# EAGLE design esp_sch (EAGLE 7.5.0)
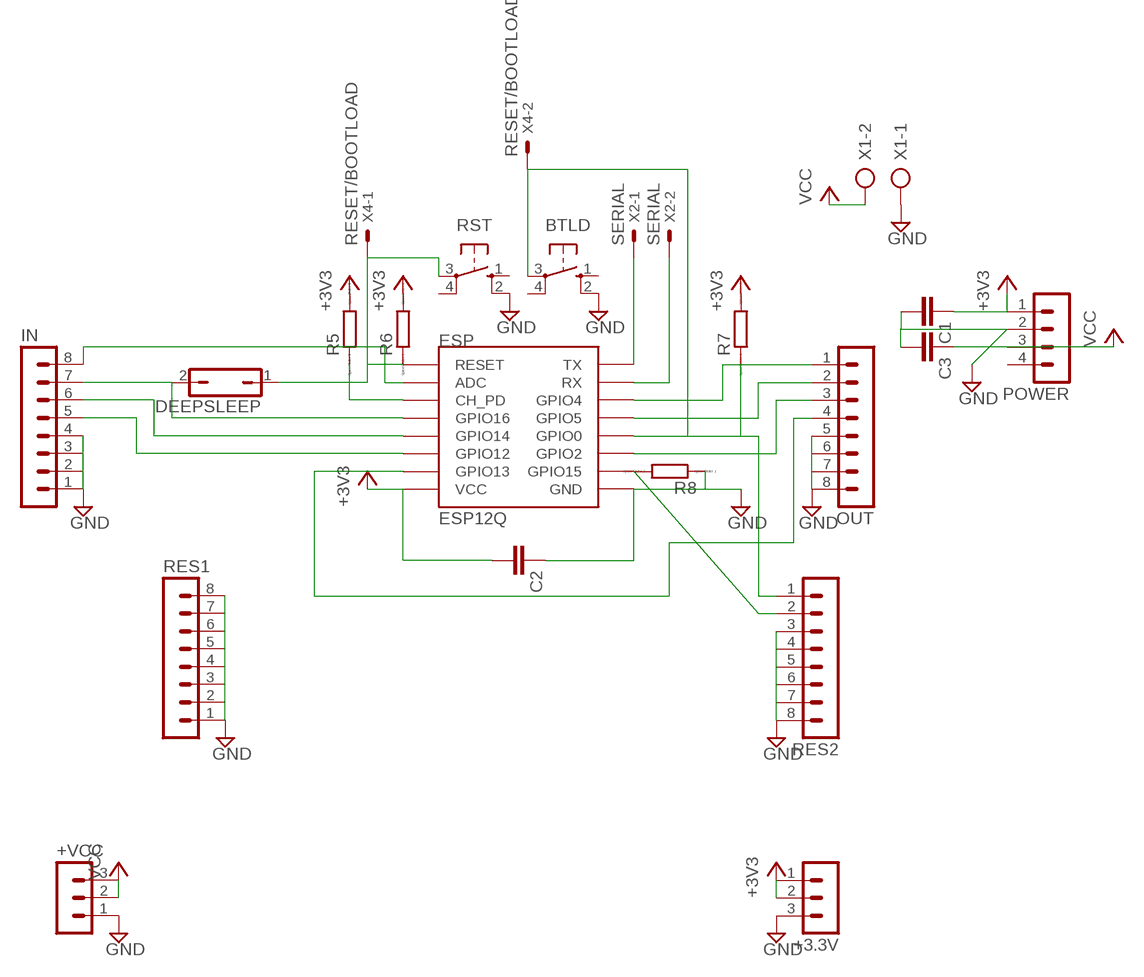
[diagram p0: schematic, sheet 1]

## Parts
+3.3V  MA03-1  [MA03-1]
+VCC  MA03-1  [MA03-1]
BTLD  10-XX  [B3F-10XX]
C1  C-EU025-024X044  [C025-024X044]
C2  C-EU025-024X044  [C025-024X044]
C3  C-EU025-024X044  [C025-024X044]
DEEPSLEEP  JP1Q  [JP1]
ESP  ESP12Q  [ESP12Q]
IN  MA08-1  [MA08-1]
OUT  MA08-1  [MA08-1]
POWER  MA04-1  [MA04-1]
R5  R  [R0805]
R6  R  [R0805]
R7  R  [R0805]
R8  R  [R0805]
RES1  MA08-1  [MA08-1]
RES2  MA08-1  [MA08-1]
RST  10-XX  [B3F-10XX]
X1  AK300/2  [AK300/2]
X2  SERIAL  332-02  [332-02]
X4  RESET/BOOTLOAD  332-02  [332-02]

## Nets
+3V3: +3.3V.1 +3.3V.2 C1.1 C2.2 ESP.VCC POWER.1 R5.2 R6.2 R7.2
GND: +3.3V.3 +VCC.1 BTLD.2(S1) C1.2 C2.1 C3.2 ESP.GND IN.1 IN.2 IN.3 IN.4 OUT.5 OUT.6 OUT.7 OUT.8 POWER.2 R8.1 RES1.1 RES1.2 RES1.3 RES1.4 RES1.5 RES1.6 RES1.7 RES1.8 RES2.3 RES2.4 RES2.5 RES2.6 RES2.7 RES2.8 RST.2(S1) X1.1
N$1: ESP.ADC IN.8
N$2: BTLD.3(P) ESP.GPIO0 R7.1 RES2.1 X4.2
N$3: ESP.CH_PD R5.1
N$4: ESP.GPIO15 R8.2 RES2.2
N$5: ESP.TX X2.1
N$6: ESP.RX X2.2
N$7: ESP.GPIO14 IN.6
N$8: ESP.GPIO12 IN.5
N$9: ESP.GPIO13 OUT.4
N$10: ESP.GPIO4 OUT.1
N$11: ESP.GPIO5 OUT.2
N$12: DEEPSLEEP.2 ESP.GPIO16 IN.7
N$13: ESP.GPIO2 OUT.3
N$15: DEEPSLEEP.1 ESP.RESET R6.1 RST.3(P) X4.1
VCC: +VCC.2 +VCC.3 C3.1 POWER.3 X1.2
Unconnected: BTLD.1(S) BTLD.4(P1) POWER.4 RST.1(S) RST.4(P1)

## Library data of the parts
+3.3V +VCC = con-lstb:MA03-1: PIN HEADER; OC_FARNELL: unknown; OC_NEWARK: unknown
BTLD RST = switch-omron:10-XX: OMRON SWITCH; MPN: B3F-1000; OC_FARNELL: 176432; OC_NEWARK: 36M3542
C1-C3 = rcl:C-EU: CAPACITOR, European symbol
DEEPSLEEP = jumper:JP1Q: JUMPER
ESP = esp826612q:ESP12Q
IN OUT RES1 RES2 = con-lstb:MA08-1: PIN HEADER; OC_FARNELL: unknown; OC_NEWARK: unknown
POWER = con-lstb:MA04-1: PIN HEADER; OC_FARNELL: unknown; OC_NEWARK: unknown
R5-R8 = eagle-ltspice:R: RESISTOR, European symbol; SPICEMODEL: NONE; SPICEPREFIX: R
X1 = con-ptr500:AK300/2: CONNECTOR; OC_FARNELL: unknown; OC_NEWARK: unknown
X2 X4 = con-garry:332-02: 2 Pin - 2mm Dual Row Source: www.mpe-connector.de / garry_shortform_2012.pdf

## Board
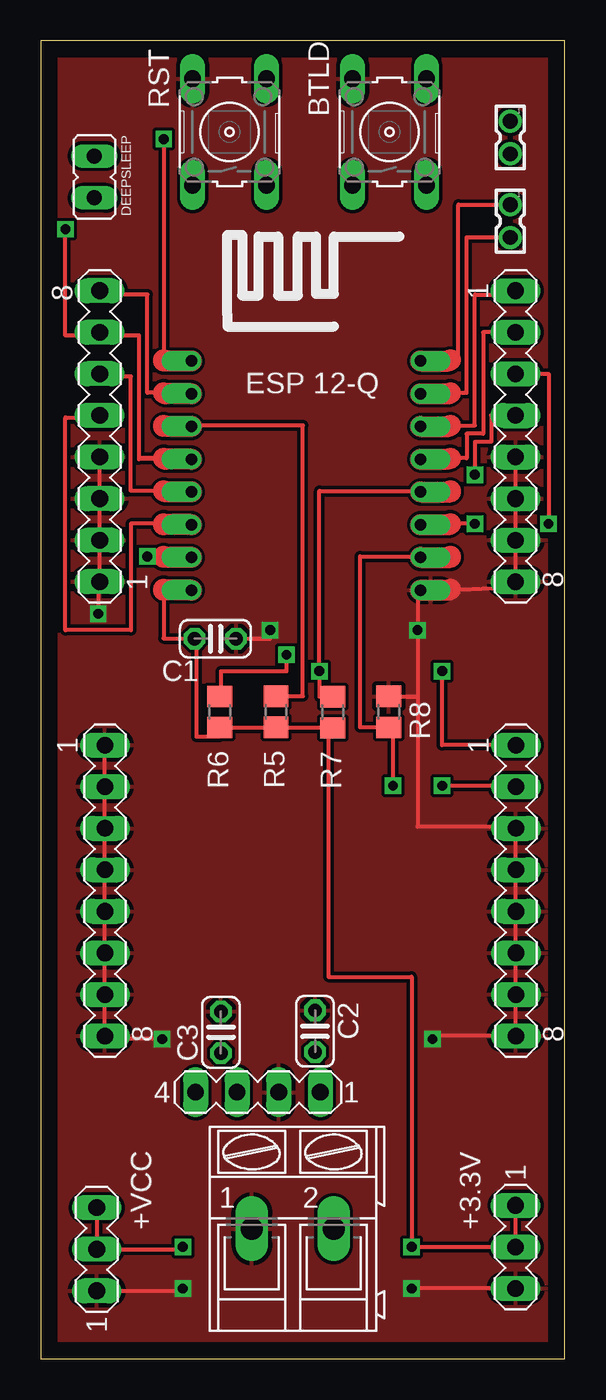
[diagram p1: board, top side]
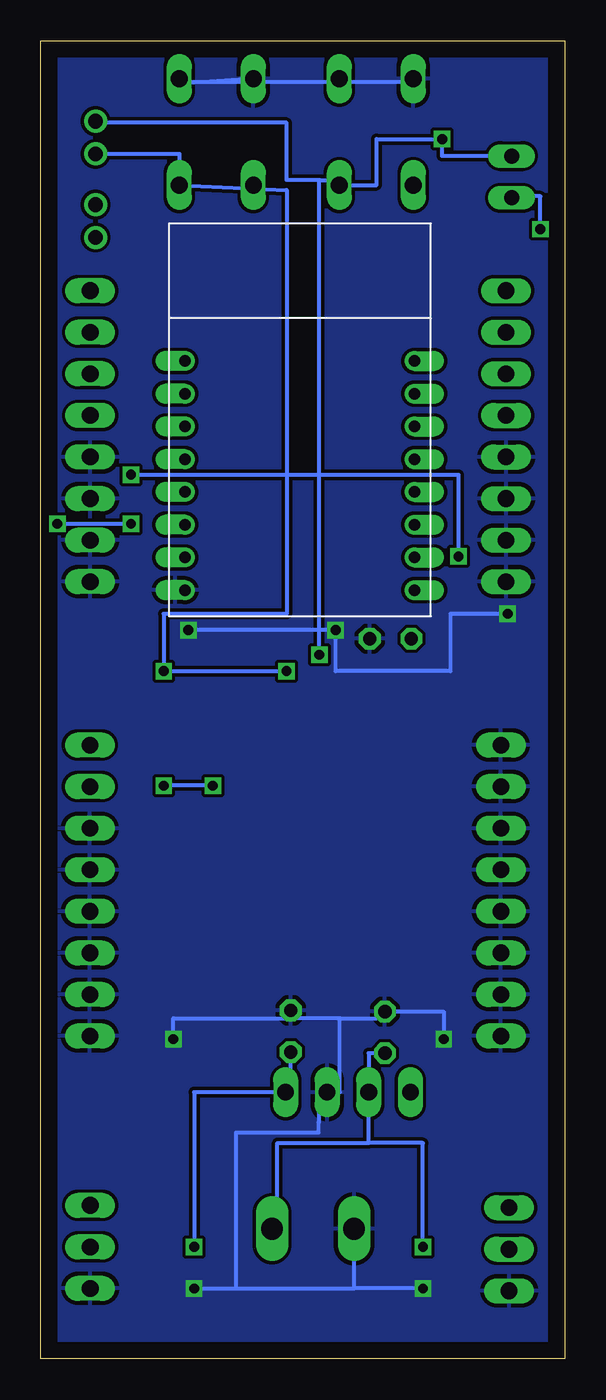
[diagram p2: board, bottom side, seen from below]

Size 32 x 80.5 mm. Coordinates in mm from the lower left corner, seen from the top.
Outline: 0,0 32,0 32,80.5 0,80.5 0,0
Copper layers (1*16): Top 0.035mm / dielectric 1.5mm / Bottom 0.035mm
Design rules "default": minimum track width 10mil, minimum drill 24mil, track to track 8mil, track to pad 8mil, pad to pad 8mil, via to via 8mil, smd to smd 8mil, copper to edge 40mil, drill to drill 8mil, minimum pad ring 10mil, minimum via ring 8mil, stop-mask expansion 4mil, vias tented up to drill 0mil, thermal gap 10mil

### Footprints (pad centres in the part's own frame; a part is rotated, then mirrored left to right if it is on the bottom)
MA03-1 = drill 1.016 long: 1 -2.54,0; 2 0,0; 3 2.54,0
B3F-10XX = drill 1.016 long: 1 -3.251,2.261; 2 3.251,2.261; 3 -3.251,-2.261; 4 3.251,-2.261
C025-024X044 = drill 0.813 octagon: 1 -1.27,0; 2 1.27,0
JP1 = drill 0.914 long: 1 0,-1.27; 2 0,1.27
ESP12Q = drill 0.7 offset: ADC -7.1,3.8; CH_PD -7.1,1.8; GND 6.9,-8.2; GPIO0 6.9,-2.2; GPIO2 6.9,-4.2; GPIO4 6.9,1.8; GPIO5 6.9,-0.2; GPIO12 -7.1,-4.2; GPIO13 -7.1,-6.2; GPIO14 -7.1,-2.2; GPIO15 6.9,-6.2; GPIO16 -7.1,-0.2; RESET -7.1,5.8; RX 6.9,3.8; TX 6.9,5.8; VCC -7.1,-8.2
MA08-1 = drill 1.016 long: 1 -8.89,0; 2 -6.35,0; 3 -3.81,0; 4 -1.27,0; 5 1.27,0; 6 3.81,0; 7 6.35,0; 8 8.89,0
MA04-1 = drill 1.016 long: 1 -3.81,0; 2 -1.27,0; 3 1.27,0; 4 3.81,0
R0805 = smd 1.3 x 1.5: 1 -0.95,0; 2 0.95,0
AK300/2 = drill 1.321 long: 1 -2.515,0; 2 2.489,0
332-02 = drill 0.9 pad 1.27: 1 0,-1; 2 0,1

### Placement (x,y rotation side)
+3.3V  28.99,6.82 270 top
+VCC  3.41,6.68 90 top
BTLD  21.29,74.94 90 top
C1  10.65,43.98 0 top
C2  16.74,20 270 top
C3  10.99,19.93 90 top
DEEPSLEEP  3.26,72.19 180 top
ESP  16.29,55.15 0 top
IN  3.59,56.35 90 top
OUT  28.99,56.35 270 top
POWER  13.25,16.27 180 top
R5  14.35,39.52 270 top
R6  10.92,39.5 270 top
R7  17.82,39.48 270 top
R8  21.24,39.51 270 top
RES1  3.91,28.59 270 top
RES2  29.01,28.59 270 top
RST  11.52,74.94 90 top
X1  15.39,7.93 0 top
X2  28.66,69.49 180 top
X4  28.66,74.6 180 top

### Tracks (layer width: path | path; a pad name or v marks a point on that pad's centre or on a via)
+3V3  (via drill 0.6)
  Top 0.254: +3.3V.1 +3.3V.2 v22.64,6.82 22.64,23.33 17.56,23.33 17.56,38.53 R7.2 14.35,38.53 | 14.35,38.53 R5.2 | 14.35,38.53 10.92,38.53 R6.2 10.92,38 9.5,38 9.5,43.98 C1.1 9.38,44 7.5,44 7.5,46.95
  Top 1.27: ESP.VCC 7.5,46.95 7.5,47
  Bottom 0.254: v22.64,6.82 22.64,16.27 POWER.1 16.74,16.27 C2.2
GND  (via drill 0.6)
  Top 0.254: +VCC.1 8.67,4.14 v8.67,4.28 | +3.3V.3 v22.64,4.28 | v23.91,19.52 23.91,19.7 RES2.8 RES2.7 RES2.6 RES2.5 RES2.4 RES2.3 29.01,32.5 23,32.5 23,40.46 | v7.4,19.52 3.91,19.52 RES1.8 RES1.7 RES1.6 RES1.5 RES1.4 RES1.3 RES1.2 RES1.1 | C1.2 14,43.98 v14,44.5 | 23,40.46 v23,44.5 23,47.15 24.9,46.95 28.99,47.15 OUT.8 OUT.7 OUT.6 OUT.5 | R8.1 23,40.46 | IN.4 IN.3 IN.2 IN.1 3.5,47.46 v3.5,45.5
  Top 1.27: ESP.GND 24.9,46.95 25,47
  Bottom 0.254: v8.67,4.28 12.88,4.28 | 12.88,4.28 X1.1 | v22.64,4.28 20.1,4.28 | 20.1,4.28 12.88,4.28 | 20.1,4.28 20.1,13.8 15.05,13.8 15.05,14.44 15.02,14.44 15.02,16.27 POWER.2 13.75,16.27 13.75,20.79 | 13.75,20.79 11.49,20.79 C3.2 7.4,21.2 v7.4,19.52 | 13.75,20.79 16.74,20.79 | v23.91,19.52 23.91,20.79 16.74,20.79 | 16.74,20.79 C2.1 | v23,44.5 v14,44.5 14,42 7,42 7,45.5 v3.5,45.5 | BTLD.2 23.5,77.89 23.5,78 9.26,78 RST.2
  pour Top: 0,80.5 32,80.5 32,0 0,0
  pour Bottom: 0,80.5 0,0 32.5,0 32.5,80.5
N$1
  Top 0.254: 7.5,59 6.5,59 6.5,65 3.59,65 IN.8
  Top 1.27: ESP.ADC 7.6,58.95 7.5,59
N$2  (via drill 0.6)
  Top 0.254: R7.1 17,40.43 v17,42 17,53 23.29,53 ESP.GPIO0 | RES2.1 24.5,37.48 v24.5,42
  Top 1.27: ESP.GPIO0 25,52.95 25,53
  Bottom 0.254: v17,42 v24.5,42 24.5,45.5 17,45.5 17,71.39 BTLD.3 23.55,73.6 X4.2
N$3
  Top 0.254: R5.1 16,40.47 16,57 9.29,57 ESP.CH_PD
  Top 1.27: ESP.CH_PD 7.5,56.95 7.5,57
N$4  (via drill 0.6)
  Top 0.254: ESP.GPIO15 23.29,49 19.5,49 19.5,38.56 R8.2 21.5,38.56 v21.5,35 | v24.5,35 29.01,35 RES2.2
  Top 1.27: ESP.GPIO15 25,48.95 25,49
  Bottom 0.254: v21.5,35 v24.5,35
N$5
  Top 0.254: 25,61 25.5,61 25.5,70.5 X2.1
  Top 1.27: ESP.TX 24.9,60.95 25,61
N$6
  Top 0.254: 25,59 26,59 26,68.5 X2.2
  Top 1.27: ESP.RX 24.9,58.95 25,59
N$7
  Top 0.254: 7.5,53 5.5,53 5.5,60 3.59,60 IN.6
  Top 1.27: ESP.GPIO14 7.6,52.95 7.5,53
N$8
  Top 0.254: 7.5,51 5.5,51 5.5,44.5 1.5,44.5 1.5,57.5 3.59,57.5 IN.5
  Top 1.27: ESP.GPIO12 7.5,50.95 7.5,51
N$9  (via drill 0.6)
  Top 0.254: OUT.4 27.5,57.62 27.5,56 26.5,56 v26.5,54 | v6.5,49 7.5,49
  Top 1.27: ESP.GPIO13 7.5,48.95 7.5,49
  Bottom 0.254: v26.5,54 6.5,54 v6.5,49
N$10
  Top 0.254: 25,57 26.5,57 26.5,65 28.75,65 OUT.1
  Top 1.27: ESP.GPIO4 24.9,56.95 25,57
N$11
  Top 0.254: OUT.2 27,62.7 27,56.5 26,56.5 26,55 25,55
  Top 1.27: ESP.GPIO5 24.8,54.95 25,55
N$12  (via drill 0.6)
  Top 0.254: ESP.GPIO16 6,54.95 6,55 | 3.59,62.5 6,62.5 6,55 | 3.59,62.5 IN.7 | 7.5,55 6,55 | 3.59,62.5 1.5,62.5 v1.5,69
  Top 1.27: ESP.GPIO16 7.6,54.95 7.5,55
  Bottom 0.254: v1.5,69 1.5,71 3.26,71 DEEPSLEEP.2
N$13  (via drill 0.6)
  Top 0.254: OUT.3 31,60.16 v31,51 | v26.5,51 23.29,51 ESP.GPIO2
  Top 1.27: ESP.GPIO2 24.9,50.95 25,51
  Bottom 0.254: v31,51 v26.5,51
N$15  (via drill 0.6)
  Top 0.254: R6.1 11,40.45 11,42 15,42 v15,43 | v7.5,74.5 7.5,60.95
  Top 1.27: ESP.RESET 7.5,60.95 7.5,61
  Bottom 0.254: v15,43 15,72 | 15,72 13.78,72 RST.3 11.5,71.69 11.5,74.5 v7.5,74.5 7.5,73.46 DEEPSLEEP.1 | 15,72 17,72 17,75.5 28.66,75.5 X4.1
VCC  (via drill 0.6)
  Top 0.254: +VCC.3 +VCC.2 8.67,6.68 v8.67,6.82
  Bottom 0.254: v8.67,6.82 8.67,13.17 11.98,13.17 | 11.98,13.17 POWER.3 11.98,18.66 C3.1 | X1.2 17.56,7.93 17.56,13.17 11.98,13.17